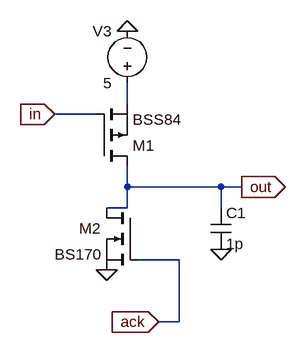
[diagram p0: schematic pixel.asc]
pixel.asc, the LTspice schematic file:
Version 4.1
SHEET 1 880 680
WIRE 304 0 304 -32
WIRE 256 16 192 16
WIRE 304 128 304 96
WIRE 448 128 304 128
WIRE 480 128 448 128
WIRE 304 160 304 128
WIRE 304 160 272 160
WIRE 448 160 448 128
WIRE 384 240 320 240
WIRE 384 336 384 240
WIRE 384 336 352 336
FLAG 448 224 0
FLAG 272 256 0
FLAG 304 -112 0
FLAG 480 128 out
IOPIN 480 128 Out
FLAG 352 336 ack
IOPIN 352 336 In
FLAG 192 16 in
IOPIN 192 16 In
SYMBOL pmos 256 96 M180
SYMATTR InstName M1
SYMATTR Value BSS84
SYMBOL nmos 320 160 M0
SYMATTR InstName M2
SYMATTR Value BS170
SYMBOL cap 432 160 R0
SYMATTR InstName C1
SYMATTR Value 1p
SYMBOL voltage 304 -16 R180
WINDOW 0 24 96 Left 2
WINDOW 3 24 16 Left 2
WINDOW 123 0 0 Left 0
WINDOW 39 0 0 Left 0
SYMATTR InstName V3
SYMATTR Value 5

The netlist it stands for:
* pixel.asc
M1 out in N001 N001 BSS84
M2 out ack 0 0 BS170
C1 out 0 1p
V3 N001 0 5
.model NMOS NMOS
.model PMOS PMOS
.lib standard.mos
.backanno
.end